# Altium schematic sheet cc2510.SchDoc
size A3
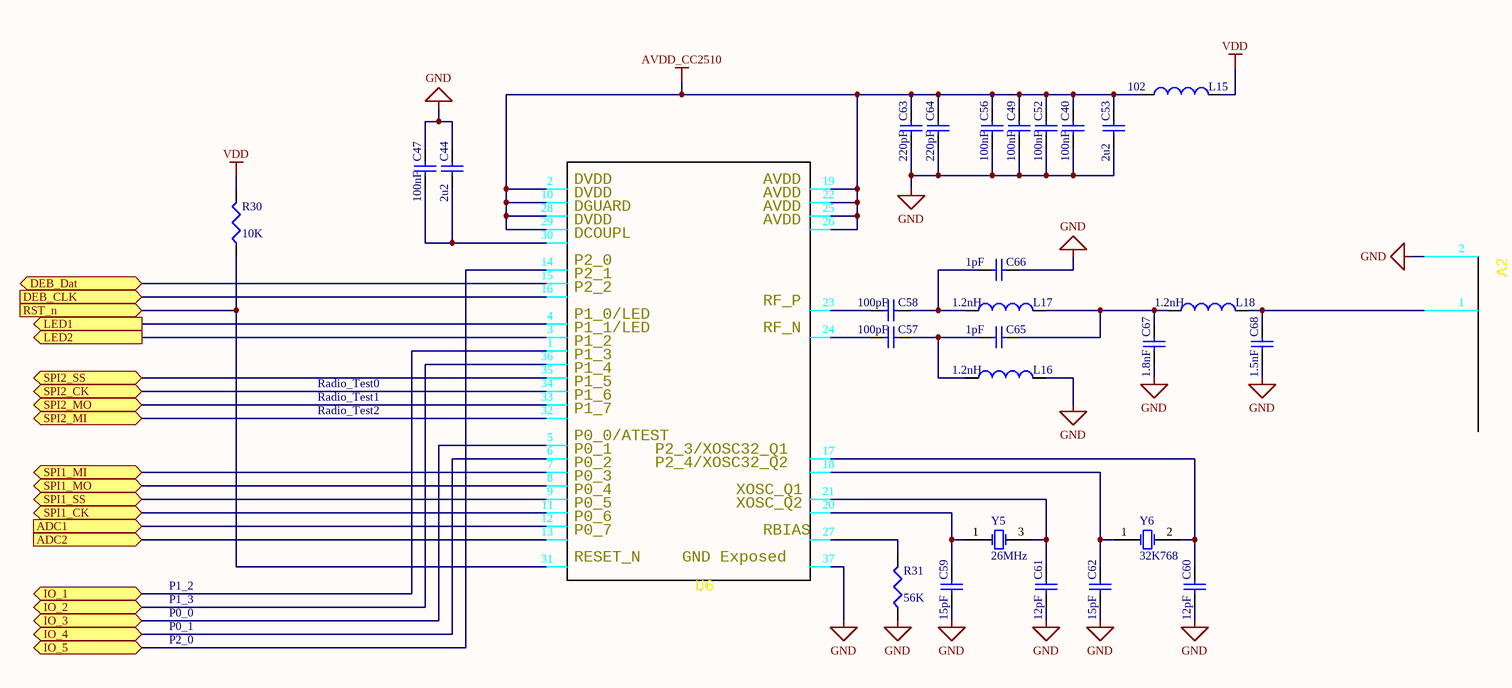
[diagram p0: cc2510.SchDoc]

## Parts
A2  Antenna_IIFA_1  [antenna_IIFA_1]  (value not drawn)
C40  value 100nF  [0402]  (hidden comment: Cap)
C44  value 2u2  [C0805]  (hidden comment: Cap)
C47  value 100nF  [0402]  (hidden comment: Cap)
C49  value 100nF  [0402]  (hidden comment: Cap)
C52  value 100nF  [0402]  (hidden comment: Cap)
C53  value 2u2  [C0805]  (hidden comment: Cap)
C56  value 100nF  [0402]  (hidden comment: Cap)
C57  value 100pF  [0402]  (hidden comment: Cap)
C58  value 100pF  [0402]  (hidden comment: Cap)
C59  value 15pF  [0402]  (hidden comment: Cap)
C60  value 12pF  [0402]  (hidden comment: Cap)
C61  value 12pF  [0402]  (hidden comment: Cap)
C62  value 15pF  [0402]  (hidden comment: Cap)
C63  value 220pF  [0402]  (hidden comment: Cap)
C64  value 220pF  [0402]  (hidden comment: Cap)
C65  value 1pF  [0402]  (hidden comment: Cap)
C66  value 1pF  [0402]  (hidden comment: Cap)
C67  value 1.8nF  [0402]  (hidden comment: Cap)
C68  value 1.5nF  [0402]  (hidden comment: Cap)
L15  value 102  [0402-A]  (hidden comment: Inductor)
L16  value 1.2nH  [0402-A]  (hidden comment: Inductor)
L17  value 1.2nH  [0402-A]  (hidden comment: Inductor)
L18  value 1.2nH  [0402-A]  (hidden comment: Inductor)
R30  value 10K  [J1-0603]  (hidden comment: Res3)
R31  value 56K  [J1-0603]  (hidden comment: Res3)
U6  CC2510  [QLP36_4_4 norteam silk (Reflow)]  (value not drawn)
Y5  26MHz  [xtal_3225]
Y6  32K768  [xtal_3215]

## Ports
ADC1 (in), ADC2 (in), DEB_CLK (in), DEB_Dat (bidir), IO_1 (bidir), IO_2 (bidir), IO_3 (bidir), IO_4 (bidir), IO_5 (bidir), LED1 (out), LED2 (out), RST_n (in), SPI1_CK (bidir), SPI1_MI (bidir), SPI1_MO (bidir), SPI1_SS (bidir), SPI2_CK (bidir), SPI2_MI (bidir), SPI2_MO (bidir), SPI2_SS (bidir)

## Nets
AVDD_CC2510: C40.2 C49.2 C52.2 C53.2 C56.2 C63.2 C64.2 L15.1 U6.2 U6.10 U6.19 U6.22 U6.25 U6.26 U6.28 U6.29
GND: A2.2 C40.1 C44.2 C47.2 C49.1 C52.1 C53.1 C56.1 C59.1 C60.1 C61.1 C62.1 C63.1 C64.1 C66.1 C67.1 C68.1 L16.2 R31.1 U6.37
VDD: L15.2 R30.2
ADC1: U6.12 ; port ADC1
ADC2: U6.13 ; port ADC2
DEB_CLK: U6.16 ; port DEB_CLK
DEB_Dat: U6.15 ; port DEB_Dat
IO_1: U6.1 ; port IO_1
IO_2: U6.36 ; port IO_2
IO_3: U6.5 ; port IO_3
IO_4: U6.6 ; port IO_4
IO_5: U6.14 ; port IO_5
LED1: U6.4 ; port LED1
LED2: U6.3 ; port LED2
RST_n: R30.1 U6.31 ; port RST_n
SPI1_CK: U6.11 ; port SPI1_CK
SPI1_MI: U6.7 ; port SPI1_MI
SPI1_MO: U6.8 ; port SPI1_MO
SPI1_SS: U6.9 ; port SPI1_SS
SPI2_CK: U6.34 ; port SPI2_CK
SPI2_MI: U6.32 ; port SPI2_MI
SPI2_MO: U6.33 ; port SPI2_MO
SPI2_SS: U6.35 ; port SPI2_SS
NetA2_1: A2.1 C68.2 L18.2
NetC44_1: C44.1 C47.1 U6.30
NetC57_1: C57.1 C65.2 L16.1
NetC57_2: C57.2 U6.24
NetC58_1: C58.1 C66.2 L17.1
NetC58_2: C58.2 U6.23
NetC59_2: C59.2 U6.20 Y5.1(OSC1)
NetC60_2: C60.2 U6.17 Y6.2(OSC2)
NetC61_2: C61.2 U6.21 Y5.3(OSC2)
NetC62_2: C62.2 U6.18 Y6.1(OSC1)
NetC65_1: C65.1 C67.2 L17.2 L18.1
NetR31_2: R31.2 U6.27

## Notes on the sheet
- Radio_Test0
- Radio_Test1
- Radio_Test2
- P1_2
- P1_3
- P0_0
- P0_1
- P2_0
- (in symbol CC2510) DVDD; AVDD; DGUARD; DCOUPL; P2_0; P2_1; P2_2; RF_P; P1_0/LED; P1_1/LED; RF_N; P1_2; P1_3; P1_4; P1_5; P1_6; P1_7; P0_0/ATEST; P0_1; P2_3/XOSC32_Q1; P0_2; P2_4/XOSC32_Q2; P0_3; P0_4; XOSC_Q1; P0_5; XOSC_Q2; P0_6; P0_7; RBIAS; RESET_N; GND Exposed

## Library data of the parts
A2 = Antenna_IIFA_1: Antenna single ended IIFA, 2450 MHz
C40 C47 C49 C52 C56 = Cap: Capacitor; Manufacturer: FARNELL; RS: 788-2843; Order N: 2309011; Published: 8-Jun-2000; LatestRevisionDate: 17-Jul-2002; LatestRevisionNote: Re-released for DXP Platform.; PackageReference: RAD-0.3; Publisher: Altium Limited; PackageDescription: Radial Cap, Thru-Hole; 2 Leads; 0.3 in Pin Spacing; FARNELL: 2309011
C44 C53 = Cap: Capacitor; Manufacturer: FARNELL; RS: 749-2138; Order N: 1759416; Published: 8-Jun-2000; LatestRevisionDate: 17-Jul-2002; LatestRevisionNote: Re-released for DXP Platform.; PackageReference: RAD-0.3; Publisher: Altium Limited; PackageDescription: Radial Cap, Thru-Hole; 2 Leads; 0.3 in Pin Spacing; FARNELL: 1759416
C57 C58 = Cap: Capacitor; Manufacturer: FARNELL; RS: 806-8495; Order N: 2426878; Published: 8-Jun-2000; LatestRevisionDate: 17-Jul-2002; LatestRevisionNote: Re-released for DXP Platform.; PackageReference: RAD-0.3; Publisher: Altium Limited; PackageDescription: Radial Cap, Thru-Hole; 2 Leads; 0.3 in Pin Spacing; FARNELL: 2426878
C59 C62 = Cap: Capacitor; Manufacturer: FARNELL; RS: 788-0266; Order N: 2218840; Published: 8-Jun-2000; LatestRevisionDate: 17-Jul-2002; LatestRevisionNote: Re-released for DXP Platform.; PackageReference: RAD-0.3; Publisher: Altium Limited; PackageDescription: Radial Cap, Thru-Hole; 2 Leads; 0.3 in Pin Spacing; FARNELL: 2218840
C60 C61 = Cap: Capacitor; Manufacturer: FARNELL; RS: 788-0263; Order N: 2210762; Published: 8-Jun-2000; LatestRevisionDate: 17-Jul-2002; LatestRevisionNote: Re-released for DXP Platform.; PackageReference: RAD-0.3; Publisher: Altium Limited; PackageDescription: Radial Cap, Thru-Hole; 2 Leads; 0.3 in Pin Spacing; FARNELL: 2210762
C63 C64 = Cap: Capacitor; Manufacturer: FARNELL; RS: 624-2941; Order N: 2426879; Published: 8-Jun-2000; LatestRevisionDate: 17-Jul-2002; LatestRevisionNote: Re-released for DXP Platform.; PackageReference: RAD-0.3; Publisher: Altium Limited; PackageDescription: Radial Cap, Thru-Hole; 2 Leads; 0.3 in Pin Spacing; FARNELL: 2426879
C65 C66 = Cap: Capacitor; Manufacturer: FARNELL; RS: 788-0279; Order N: 1611944; Published: 8-Jun-2000; LatestRevisionDate: 17-Jul-2002; LatestRevisionNote: Re-released for DXP Platform.; PackageReference: RAD-0.3; Publisher: Altium Limited; PackageDescription: Radial Cap, Thru-Hole; 2 Leads; 0.3 in Pin Spacing; FARNELL: 1611944
C67 = Cap: Capacitor; Manufacturer: FARNELL; RS: 755-2033; Order N: 1865457; Published: 8-Jun-2000; LatestRevisionDate: 17-Jul-2002; LatestRevisionNote: Re-released for DXP Platform.; PackageReference: RAD-0.3; Publisher: Altium Limited; PackageDescription: Radial Cap, Thru-Hole; 2 Leads; 0.3 in Pin Spacing; FARNELL: 1865457
C68 = Cap: Capacitor; Manufacturer: FARNELL; RS: 806-8489; Order N: 2210797; Published: 8-Jun-2000; LatestRevisionDate: 17-Jul-2002; LatestRevisionNote: Re-released for DXP Platform.; PackageReference: RAD-0.3; Publisher: Altium Limited; PackageDescription: Radial Cap, Thru-Hole; 2 Leads; 0.3 in Pin Spacing; FARNELL: 2210797
L15 = Inductor: Manufacturer: FARNELL; Code_IEC: 1005; RS: 777-6861; Order N: 1669624; Published: 8-Jun-2000; LatestRevisionDate: 29-May-2009; LatestRevisionNote: IPC-7351 Footprint Added.; PackageReference: 0402-A; Publisher: Altium Limited; PackageDescription: Chip Inductor; Code_JEITA: 0402; FARNELL: 1669624
L16-L18 = Inductor: Manufacturer: FARNELL; Code_IEC: 1005; RS: 701-6784; Order N: 1704133; Published: 8-Jun-2000; LatestRevisionDate: 29-May-2009; LatestRevisionNote: IPC-7351 Footprint Added.; PackageReference: 0402-A; Publisher: Altium Limited; PackageDescription: Chip Inductor; Code_JEITA: 0402; FARNELL: 1704133
R30 = Res3: Resistor; Manufacturer: FARNELL; RS: N.E.; Order N: 2333520; Published: 8-Jun-2000; LatestRevisionDate: 29-May-2009; LatestRevisionNote: IPC-7351 Footprint Added.; PackageReference: J1-0603; Publisher: Altium Limited; PackageDescription: Chip Resistor; FARNELL: 2333520
R31 = Res3: Resistor; Manufacturer: FARNELL; RS: N.E.; Order N: 2331750; Published: 8-Jun-2000; LatestRevisionDate: 29-May-2009; LatestRevisionNote: IPC-7351 Footprint Added.; PackageReference: J1-0603; Publisher: Altium Limited; PackageDescription: Chip Resistor; FARNELL: 2331750
U6 = CC2510: Single chip transceiver; Manufacturer: FARNELL; RS: 459-540; PN: CC2510F16RSP; Order N: 1549254; FARNELL: 1549254
Y5 = XTAL_4: Crystal Oscillator; Manufacturer: Smart Prototyping; SP: SP-C23363; RS: *; FARNELL: 2101340; Value: 26MHz; Order N: SP-C23363
Y6 = XTAL: Crystal Oscillator; Manufacturer: Smart Prototyping; SP: SP-C14473; Value: 32.768KHz; FARNELL: 2449398; Order N: SP-C14473